# EAGLE schematic dc_diff_amp (EAGLE 9.5.0)
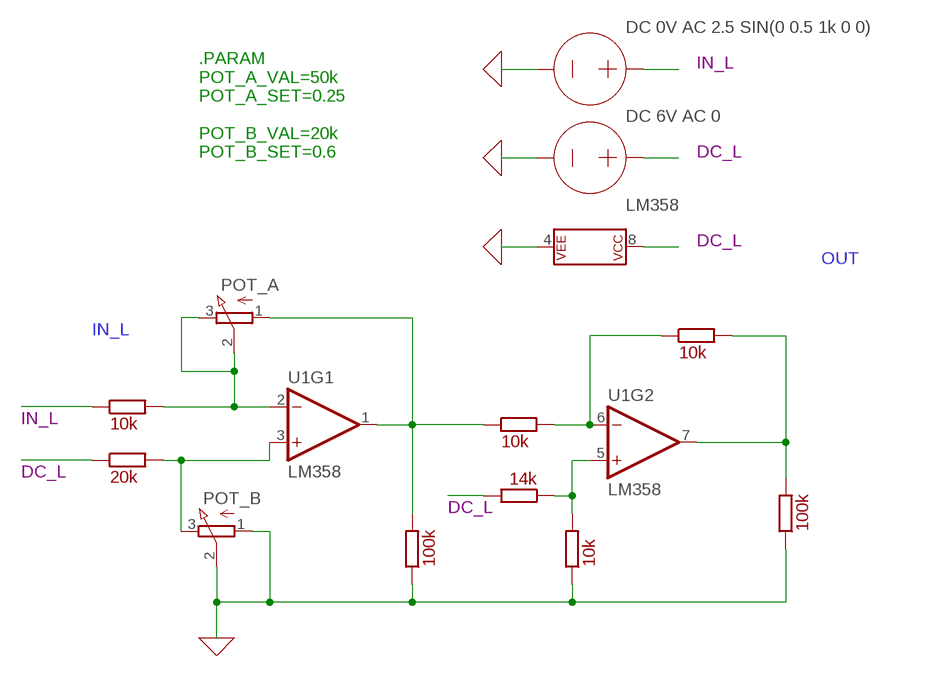
[diagram p0: schematic, sheet 1]

## Parts
R1  10k  R  [0207/12]
R2  100k  R  [0207/12]
R3  100k  R  [0207/12]
R5  20k  R  [0207/12]
R6  10k  R  [0207/12]
R7  10k  R  [0207/12]
R8  10k  R  [0207/12]
R9  14k  R  [0207/12]
U1  LM358  [DIP08]
U$1  POT_A  POTENTIOMETER  [3RP/1610N]
U$2  POT_B  POTENTIOMETER  [3RP/1610N]
VDC2  DC 6V AC 0  VOLTAGE  (no package)
VIN1  DC 0V AC 2.5 SIN(0 0.5 1k 0 0)  VOLTAGE  (no package)

## Nets
0: R2.1 R3.1 R8.1 U1.4(P$V-) U$2.1(A) U$2.2(S) VDC2.- VIN1.- ; supply symbol labelled GND
DC_L: R5.1 R9.2 U1.8(P$V+) VDC2.+
IN_L: R1.1 VIN1.+
N$1: R5.2 U1.3(+IN) U$2.3(E)
N$2: R8.2 R9.1 U1.5(+IN)
N$3: R1.2 U1.2(-IN) U$1.2(S) U$1.3(E)
N$5: R6.2 R7.1 U1.6(-IN)
OUT: R2.2 R7.2 U1.7(OUT)
VOUT_1: R3.2 R6.1 U1.1(OUT) U$1.1(A)

## Notes on the sheet
- .PARAM
  POT_A_VAL=50k
  POT_A_SET=0.25
  
  POT_B_VAL=20k
  POT_B_SET=0.6

## Library data of the parts
R1-R3 R6-R9 = adq_proc_components:R: RESISTOR
R5 = adq_proc_components:R: RESISTOR; SPICEPREFIX: R
U1 = adq_proc_components:LM358: LM358 Jellybean op-amp Datasheet <http://www.sparkfun.com/datasheets/Components/General/LM358.pdf> SparkFun Products Op-Amp (Thru-Hole) - LM358 <https://www.sparkfun.com/products/9456> (COM-09456); PROD_ID: IC-09172; SPICEMODEL: LM358_DUAL; SPICEPREFIX: X
U$1 = adq_proc_components:POTENTIOMETER: Comon circular 16mm potentiometer, see this: https://hardtofind.com.mx/pdfs/textos/P/POTWH-100K.PDF During ngspice simulation this potentiometer has to be mapped on one of two global subcitcuits: POT_A or POT_B. Each of them would require next global parameters. To add this parameters within schematics please write 'text' command and fill it with special text (with line breaks). For example: .PARAM POT_A_VAL=1k POT_A_SET=0.5 These parameters are global, so be careful and map different models to different potentiometers.; SPICEMODEL: POT_A; SPICEPREFIX: X
U$2 = adq_proc_components:POTENTIOMETER: Comon circular 16mm potentiometer, see this: https://hardtofind.com.mx/pdfs/textos/P/POTWH-100K.PDF During ngspice simulation this potentiometer has to be mapped on one of two global subcitcuits: POT_A or POT_B. Each of them would require next global parameters. To add this parameters within schematics please write 'text' command and fill it with special text (with line breaks). For example: .PARAM POT_A_VAL=1k POT_A_SET=0.5 These parameters are global, so be careful and map different models to different potentiometers.; SPICEMODEL: POT_B; SPICEPREFIX: X
VDC2 VIN1 = ngspice-simulation:VOLTAGE: Independent Voltage Source, either DC, AC, PULSE, SINE, PWL, EXP, or SFFM; VALUE: 0V